# EAGLE design mega32u4 (EAGLE 6.2)
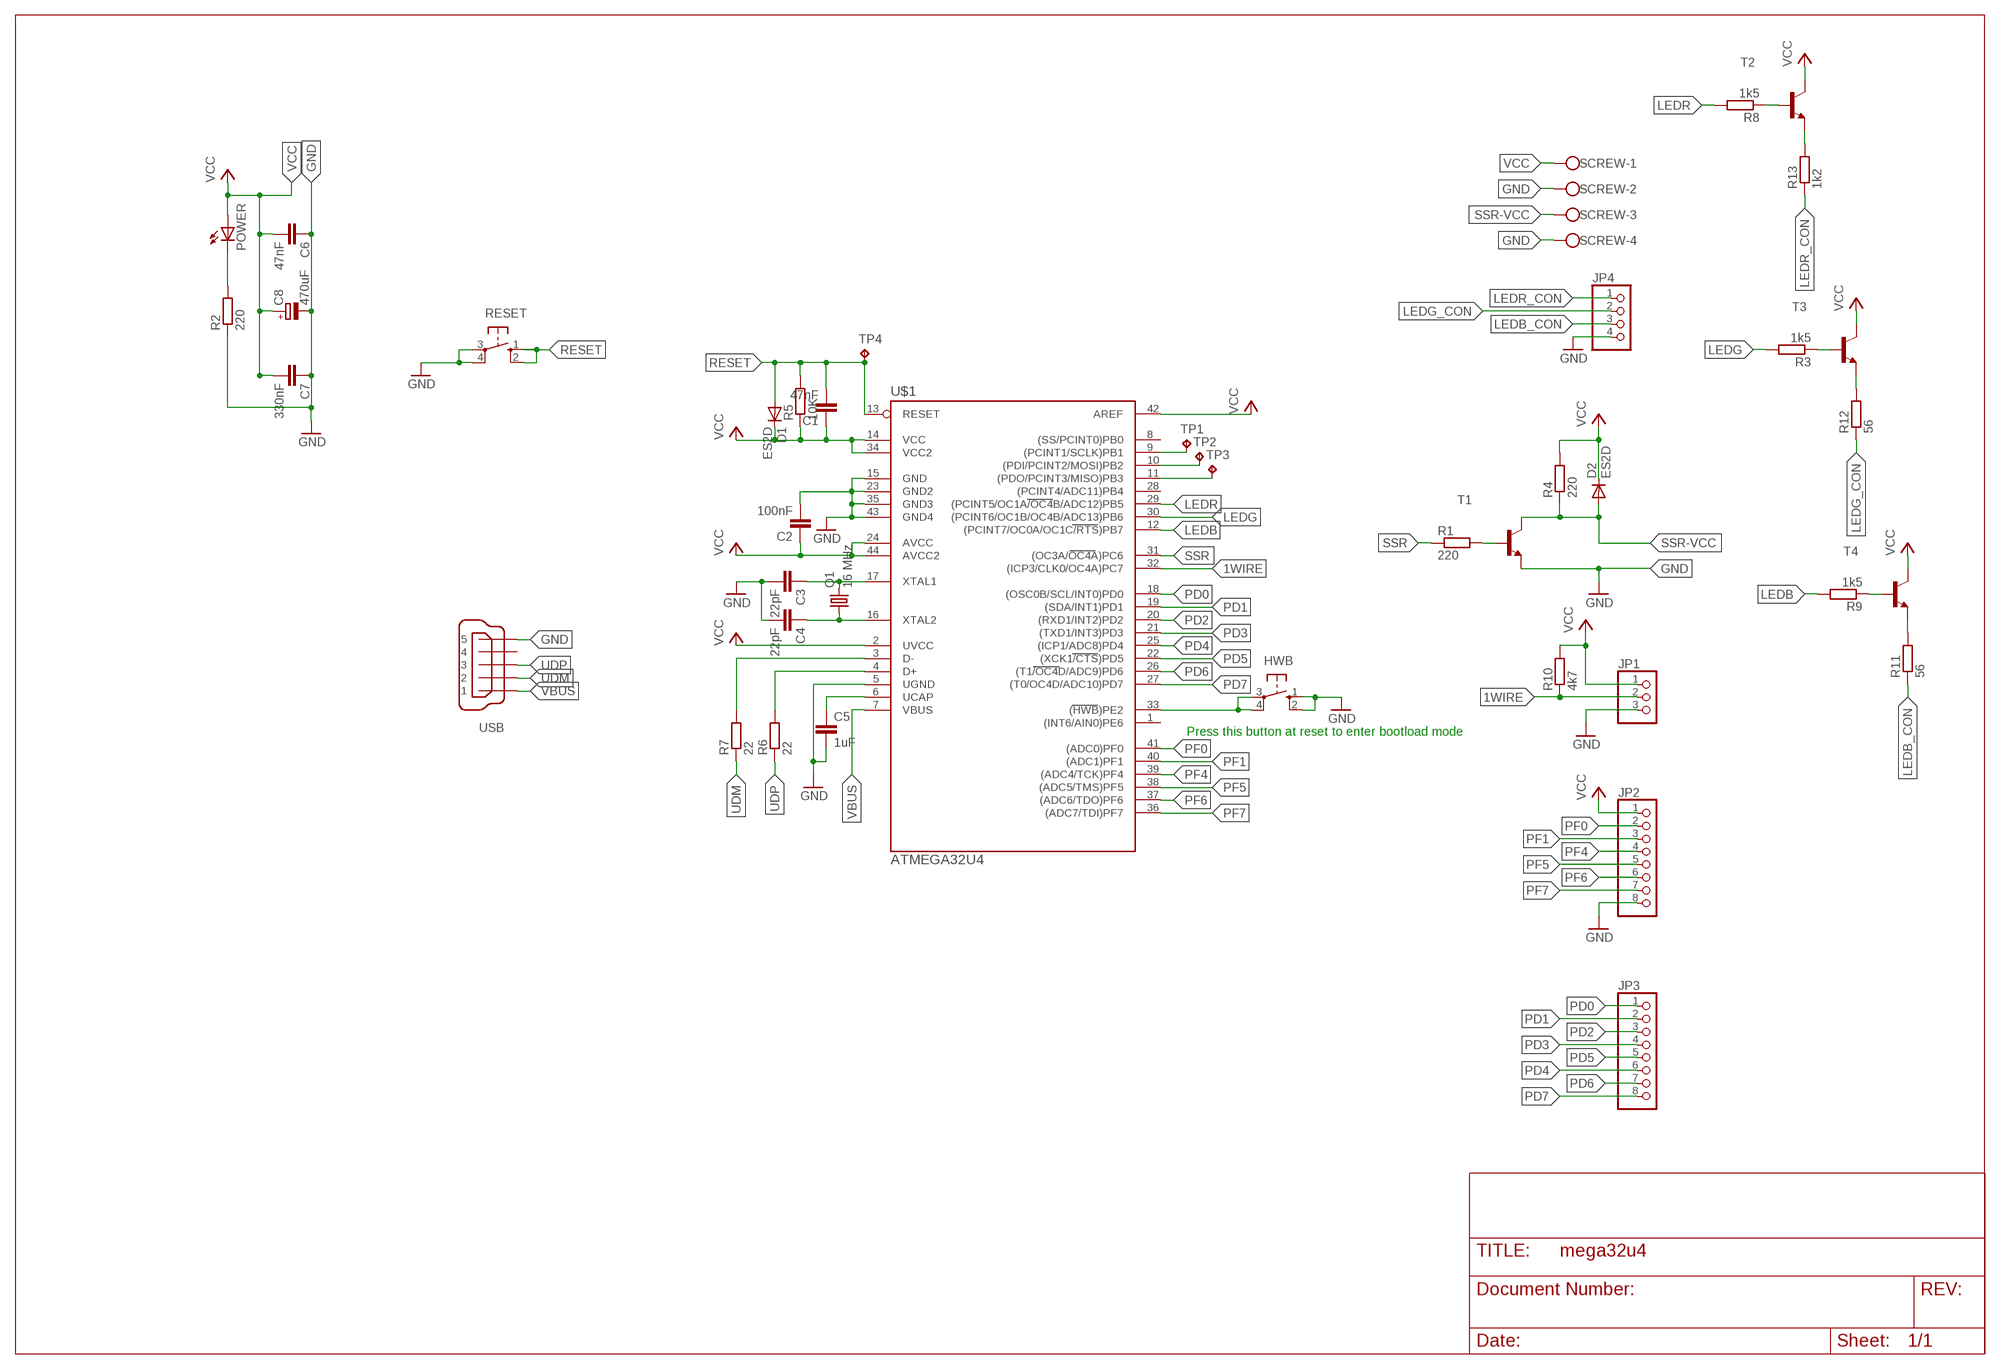
[diagram p0: schematic, sheet 1]

## Parts
C1  47nF  C-EUC0805K  [C0805K]
C2  100nF  C-EUC0805K  [C0805K]
C3  22pF  C-EUC0805K  [C0805K]
C4  22pF  C-EUC0805K  [C0805K]
C5  1uF  C-EUC0805K  [C0805K]
C6  47nF  C-EUC0805K  [C0805K]
C7  330nF  C-EUC0805K  [C0805K]
C8  470uF  CPOL-EU150CLZ-0810  [150CLZ-0810]
D1  ES2D  [SMB]
D2  ES2D  [SMB]
HWB  10-XX  [B3F-10XX]
JP1  PINHD-1X3  [1X03]
JP2  PINHD-1X8  [1X08]
JP3  PINHD-1X8  [1X08]
JP4  PINHD-1X4  [1X04]
POWER  LEDSML0805  [SML0805]
Q1  16 MHz  CRYSTALCTS406  [CTS406]
R1  220  R-EU_R0805  [R0805]
R2  220  R-EU_R0805  [R0805]
R3  1k5  R-EU_R0805  [R0805]
R4  220  R-EU_R0805  [R0805]
R5  10K  R-EU_R0805  [R0805]
R6  22  R-EU_R0805  [R0805]
R7  22  R-EU_R0805  [R0805]
R8  1k5  R-EU_R0805  [R0805]
R9  1k5  R-EU_R0805  [R0805]
R10  4k7  R-EU_R0805  [R0805]
R11  56  R-EU_R0805  [R0805]
R12  56  R-EU_R0805  [R0805]
R13  1k2  R-EU_R0805  [R0805]
RESET  10-XX  [B3F-10XX]
SCREW  W237-4  [W237-4]
T1  BC817-25-NPN-SOT23-BEC  [SOT23-BEC]
T2  BC817-25-NPN-SOT23-BEC  [SOT23-BEC]
T3  BC817-25-NPN-SOT23-BEC  [SOT23-BEC]
T4  BC817-25-NPN-SOT23-BEC  [SOT23-BEC]
TP1  TPTP10R  [TP10R]
TP2  TPTP10R  [TP10R]
TP3  TPTP10R  [TP10R]
TP4  TPTP10R  [TP10R]
U$1  ATMEGA32U4  ATMEGA32U4-AU  [TQFP44]
USB  MINI-USB-32005-201  [32005-201]

## Nets
1WIRE: JP1.2 R10.1 U$1.32((ICP3/CLK0/OC4A)PC7)
GND: C2.2 C3.2 C4.2 C5.2 C6.1 C7.1 C8.- HWB.1(S) HWB.2(S1) JP1.3 JP2.8 JP4.4 R2.1 RESET.3(P) RESET.4(P1) SCREW.2 SCREW.4 T1.E U$1.5(UGND) U$1.15(GND) U$1.23(GND2) U$1.35(GND3) U$1.43(GND4) USB.5
LEDB: R9.2 U$1.12((PCINT7/OC0A/OC1C/RTS)PB7)
LEDB_CON: JP4.3 R11.1
LEDG: R3.2 U$1.30((PCINT6/OC1B/OC4B/ADC13)PB6)
LEDG_CON: JP4.2 R12.1
LEDR: R8.2 U$1.29((PCINT5/OC1A/OC4B/ADC12)PB5)
LEDR_CON: JP4.1 R13.1
N$1: TP1.TP U$1.9((PCINT1/SCLK)PB1)
N$2: C3.1 Q1.3 U$1.17(XTAL1)
N$3: C4.1 Q1.1 U$1.16(XTAL2)
N$4: C5.1 U$1.6(UCAP)
N$5: R1.2 T1.B
N$6: R6.2 U$1.4(D+)
N$7: R7.2 U$1.3(D-)
N$8: R8.1 T2.B
N$9: R3.1 T3.B
N$10: HWB.3(P) HWB.4(P1) U$1.33((HWB)PE2)
N$11: R9.1 T4.B
N$12: TP2.TP U$1.10((PDI/PCINT2/MOSI)PB2)
N$13: POWER.C R2.2
N$14: R11.2 T4.E
N$15: R12.2 T3.E
N$16: R13.2 T2.E
N$17: TP3.TP U$1.11((PDO/PCINT3/MISO)PB3)
PD0: JP3.1 U$1.18((OSC0B/SCL/INT0)PD0)
PD1: JP3.2 U$1.19((SDA/INT1)PD1)
PD2: JP3.3 U$1.20((RXD1/INT2)PD2)
PD3: JP3.4 U$1.21((TXD1/INT3)PD3)
PD4: JP3.6 U$1.25((ICP1/ADC8)PD4)
PD5: JP3.5 U$1.22((XCK1/CTS)PD5)
PD6: JP3.7 U$1.26((T1/OC4D/ADC9)PD6)
PD7: JP3.8 U$1.27((T0/OC4D/ADC10)PD7)
PF0: JP2.2 U$1.41((ADC0)PF0)
PF1: JP2.3 U$1.40((ADC1)PF1)
PF4: JP2.4 U$1.39((ADC4/TCK)PF4)
PF5: JP2.5 U$1.38((ADC5/TMS)PF5)
PF6: JP2.6 U$1.37((ADC6/TDO)PF6)
PF7: JP2.7 U$1.36((ADC7/TDI)PF7)
RESET: C1.2 D1.A R5.2 RESET.1(S) RESET.2(S1) TP4.TP U$1.13(RESET)
SSR: R1.1 U$1.31((OC3A/OC4A)PC6)
SSR-VCC: D2.A R4.1 SCREW.3 T1.C
UDM: R7.1 USB.2
UDP: R6.1 USB.3
VBUS: U$1.7(VBUS) USB.1
VCC: C1.1 C2.1 C6.2 C7.2 C8.+ D1.C D2.C JP1.1 JP2.1 POWER.A R4.2 R5.1 R10.2 SCREW.1 T2.C T3.C T4.C U$1.2(UVCC) U$1.14(VCC) U$1.24(AVCC) U$1.34(VCC2) U$1.42(AREF) U$1.44(AVCC2)
Unconnected: U$1.1((INT6/AIN0)PE6) U$1.8((SS/PCINT0)PB0) U$1.28((PCINT4/ADC11)PB4) USB.4

## Notes on the sheet
- Press this button at reset to enter bootload mode

## Library data of the parts
C1-C7 = resistor:C-EU: CAPACITOR, European symbol
C8 = resistor:CPOL-EU: POLARIZED CAPACITOR, European symbol
D1 D2 = diode:ES2D: DIODE super fast rectifier, 2 A
HWB RESET = switch-omron:10-XX: OMRON SWITCH; MPN: B3F-1000; OC_FARNELL: 176432; OC_NEWARK: 36M3542
JP1 = pinhead:PINHD-1X3: PIN HEADER
JP2 JP3 = pinhead:PINHD-1X8: PIN HEADER
JP4 = pinhead:PINHD-1X4: PIN HEADER
POWER = led:LED: LED OSRAM: - CHIPLED LG R971, LG N971, LY N971, LG Q971, LY Q971, LO R971, LY R971 LH N974, LH R974 LS Q976, LO Q976, LY Q976 LO Q996 - Hyper CHIPLED LW Q18S LB Q993, LB Q99A, LB R99A - SideLED LS A670, LO A670, LY A670, LG A670, LP A670 LB A673, LV A673, LT A673, LW A673 LH A674 LY A675 LS A676, LA A676, LO A676, LY A676, LW A676 LS A679, LY A679, LG A679 - Hyper Micro SIDELED® LS Y876, LA Y876, LO Y876, LY Y876 LT Y87S - SmartLED LW L88C, LW L88S LB L89C, LB L89S, LG L890 LS L89K, LO L89K, LY L89K LS L896, LA L896, LO L896, LY L896 - TOPLED LS T670, LO T670, LY T670, LG T670, LP T670 LSG T670, LSP T670, LSY T670, LOP T670, LYG T670 LG T671, LOG T671, LSG T671 LB T673, LV T673, LT T673, LW T673 LH T674 LS T676, LA T676, LO T676, LY T676, LB T676, LH T676, LSB T676, LW T676 LB T67C, LV T67C, LT T67C, LS T67K, LO T67K, LY T67K, LW E67C LS E67B, LA E67B, LO E67B, LY E67B, LB E67C, LV E67C, LT E67C LW T67C LS T679, LY T679, LG T679 LS T770, LO T770, LY T770, LG T770, LP T770 LB T773, LV T773, LT T773, LW T773 LH T774 LS E675, LA E675, LY E675, LS T675 LS T776, LA T776, LO T776, LY T776, LB T776 LHGB T686 LT T68C, LB T68C - Hyper Mini TOPLED® LB M676 - Mini TOPLED Santana® LG M470 LS M47K, LO M47K, LY M47K Source: http://www.osram.convergy.de LUXEON: - LUMILED® LXK2-PW12-R00, LXK2-PW12-S00, LXK2-PW14-U00, LXK2-PW14-V00 LXK2-PM12-R00, LXK2-PM12-S00, LXK2-PM14-U00 LXK2-PE12-Q00, LXK2-PE12-R00, LXK2-PE12-S00, LXK2-PE14-T00, LXK2-PE14-U00 LXK2-PB12-K00, LXK2-PB12-L00, LXK2-PB12-M00, LXK2-PB14-N00, LXK2-PB14-P00, LXK2-PB14-Q00 LXK2-PR12-L00, LXK2-PR12-M00, LXK2-PR14-Q00, LXK2-PR14-R00 LXK2-PD12-Q00, LXK2-PD12-R00, LXK2-PD12-S00 LXK2-PH12-R00, LXK2-PH12-S00 LXK2-PL12-P00, LXK2-PL12-Q00, LXK2-PL12-R00 Source: www.luxeon.com KINGBRIGHT: KA-3528ASYC Source: www.kingbright.com
Q1 = crystal:CRYSTAL: CRYSTAL; OC_FARNELL: unknown; OC_NEWARK: unknown
R1-R13 = resistor:R-EU_: RESISTOR, European symbol
SCREW = con-wago-500:W237-4: WAGO SCREW CLAMP; OC_FARNELL: unknown; OC_NEWARK: unknown
T1-T4 = transistor-neu-to92:*-NPN-: NPN Transistror
TP1-TP4 = testpad:TP: Test pad
U$1 = mega32U4:ATMEGA32U4-AU
USB = con-cypressindustries:MINI-USB-: MINI USB-B Conector Source: www.cypressindustries.com; OC_FARNELL: unknown; OC_NEWARK: unknown

## Board
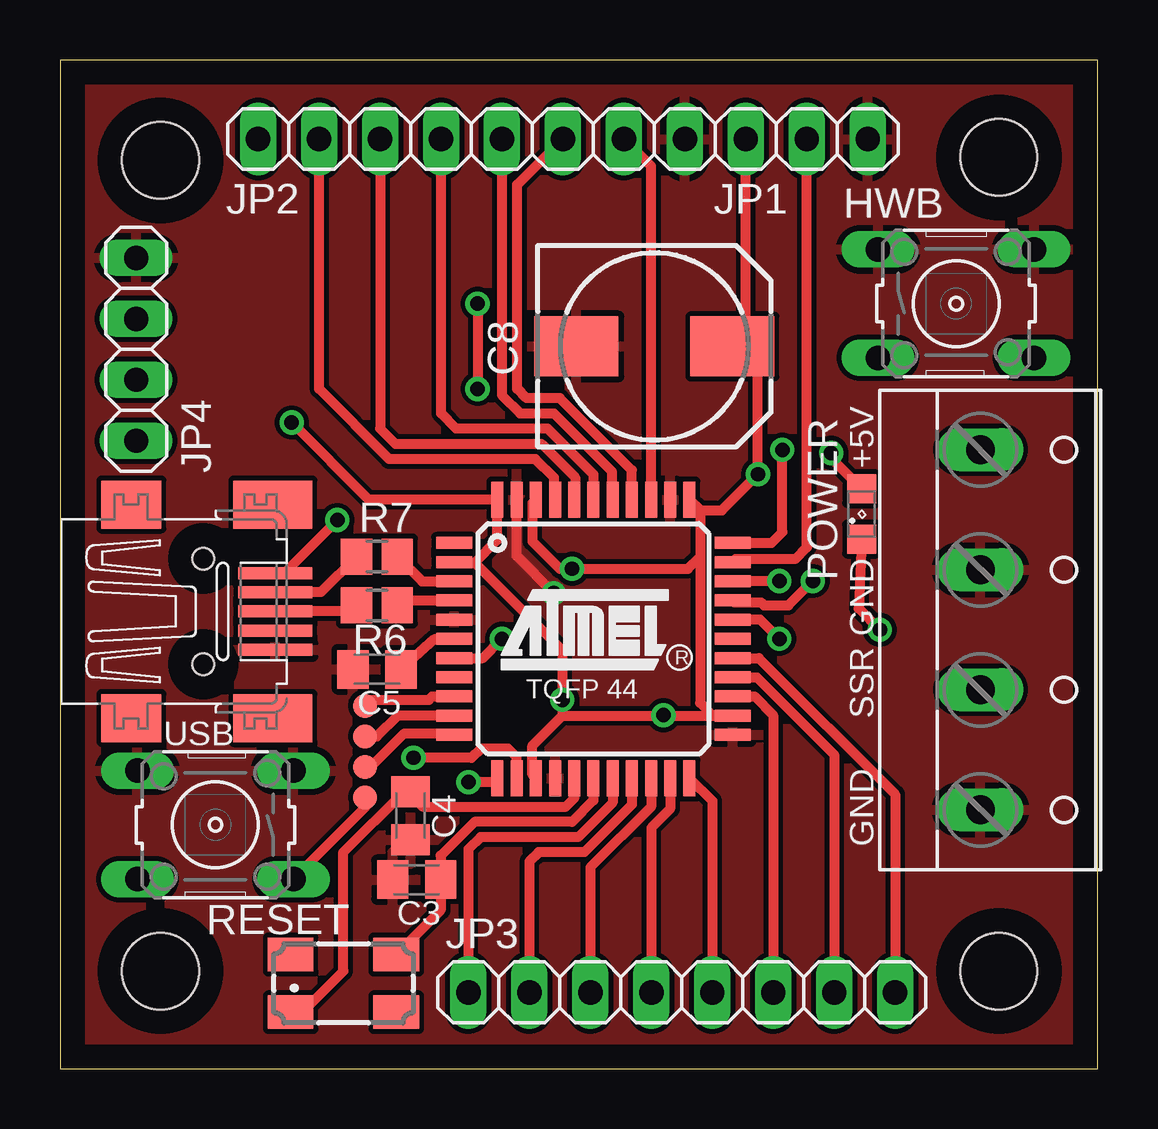
[diagram p1: board, top side]
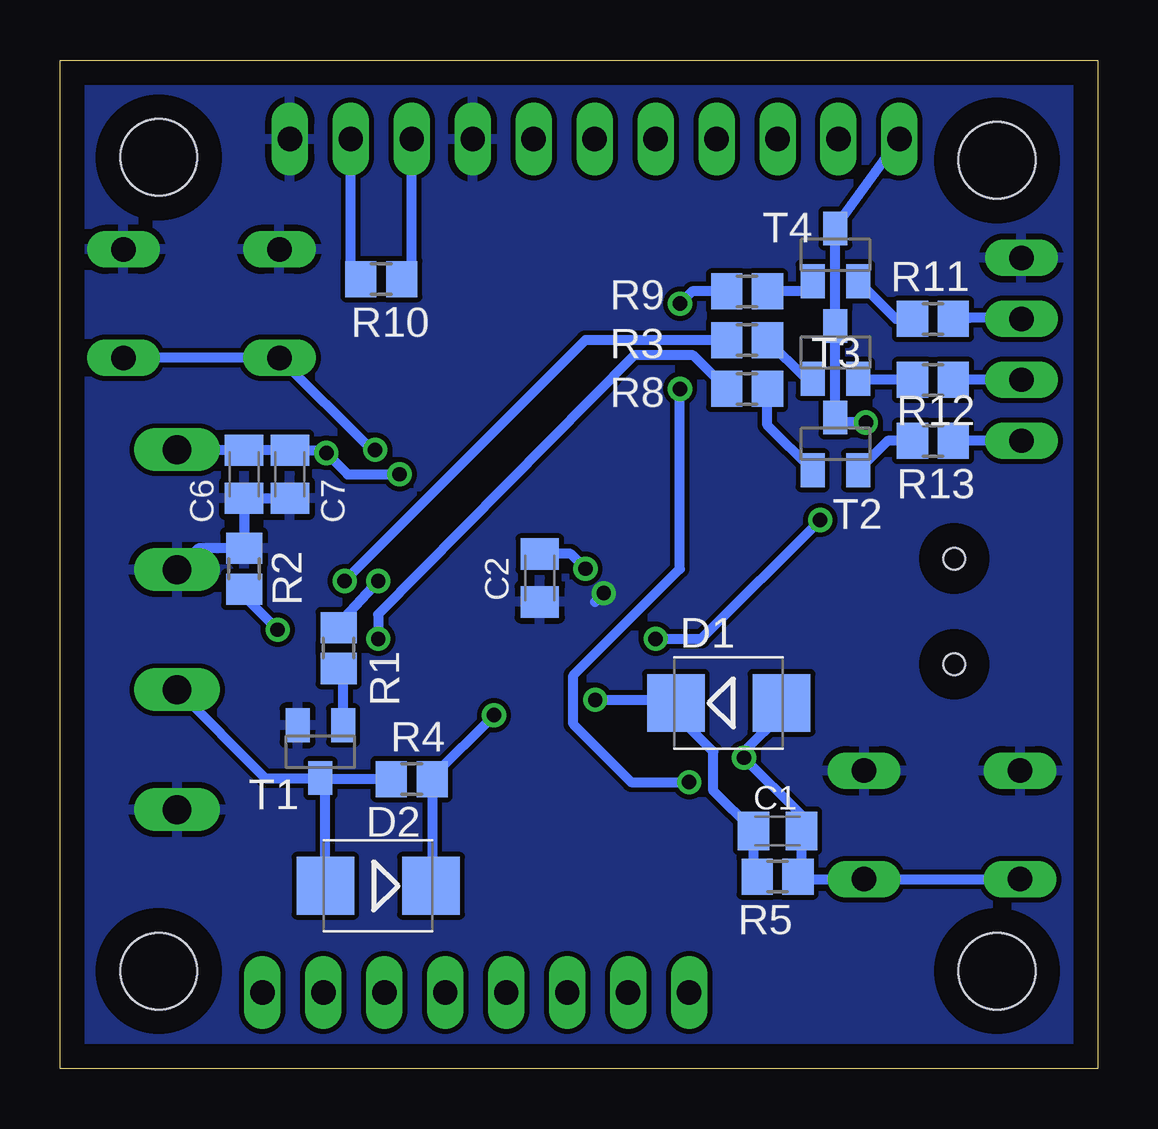
[diagram p2: board, bottom side, seen from below]

Size 43.23 x 42.03 mm. Coordinates in mm from the lower left corner, seen from the top.
Outline: 0,0 43.23,0 43.23,42.03 0,42.03 0,0
Copper layers (1*16): Top 0.035mm / dielectric 1.5mm / Bottom 0.035mm
Design rules: minimum track width 10mil, minimum drill 12mil, track to track 8mil, track to pad 8mil, pad to pad 8mil, via to via 8mil, smd to smd 8mil, copper to edge 40mil, drill to drill 8mil, minimum pad ring 10mil, minimum via ring 8mil, stop-mask expansion 4mil, vias tented up to drill 0mil, thermal gap 10mil
Holes 3.2 mm at 4.19,4.06 39.12,37.97 4.19,37.85 39.12,4.06

### Footprints (pad centres in the part's own frame; a part is rotated, then mirrored left to right if it is on the bottom)
C0805K = smd 1.3 x 1.6: 1 -1,0; 2 1,0
150CLZ-0810 = smd 3.5 x 2.5: + 3.25,0; - -3.25,0
SMB = smd 2.4 x 2.4: A 2.2,0; C -2.2,0
B3F-10XX = drill 1.016 long: 1 -3.251,2.261; 2 3.251,2.261; 3 -3.251,-2.261; 4 3.251,-2.261
1X03 = drill 1.016 long: 1 -2.54,0; 2 0,0; 3 2.54,0
1X08 = drill 1.016 long: 1 -8.89,0; 2 -6.35,0; 3 -3.81,0; 4 -1.27,0; 5 1.27,0; 6 3.81,0; 7 6.35,0; 8 8.89,0
1X04 = drill 1.016 long: 1 -3.81,0; 2 -1.27,0; 3 1.27,0; 4 3.81,0
SML0805 = smd 1.2 x 1.2: A 1.05,0; C -1.05,0
CTS406 = smd 1.9 x 1.4: 1 -2.2,-1.2; 2 2.2,-1.2; 3 2.2,1.2; 4 -2.2,1.2
R0805 = smd 1.3 x 1.5: 1 -0.85,0; 2 0.85,0
W237-4 = drill 1.194 long: 1 -7.5,-1.27; 2 -2.5,-1.27; 3 2.5,-1.27; 4 7.5,-1.27
SOT23-BEC = smd 1 x 1.4: B -0.95,-1.1; C 0,1.1; E 0.95,-1.1
TP10R = smd 1 x 1: TP 0,0
TQFP44 = smd 1.5 x 0.5: 1 -5.8,4; 2 -5.8,3.2; 3 -5.8,2.4; 4 -5.8,1.6; 5 -5.8,0.8; 6 -5.8,0; 7 -5.8,-0.8; 8 -5.8,-1.6; 9 -5.8,-2.4; 10 -5.8,-3.2; 11 -5.8,-4; 23 5.8,-4; 24 5.8,-3.2; 25 5.8,-2.4; 26 5.8,-1.6; 27 5.8,-0.8; 28 5.8,0; 29 5.8,0.8; 30 5.8,1.6; 31 5.8,2.4; 32 5.8,3.2; 33 5.8,4 | smd 0.5 x 1.5: 12 -4,-5.8; 13 -3.2,-5.8; 14 -2.4,-5.8; 15 -1.6,-5.8; 16 -0.8,-5.8; 17 0,-5.8; 18 0.8,-5.8; 19 1.6,-5.8; 20 2.4,-5.8; 21 3.2,-5.8; 22 4,-5.8; 34 4,5.8; 35 3.2,5.8; 36 2.4,5.8; 37 1.6,5.8; 38 0.8,5.8; 39 0,5.8; 40 -0.8,5.8; 41 -1.6,5.8; 42 -2.4,5.8; 43 -3.2,5.8; 44 -4,5.8
32005-201 = smd 3.1 x 0.5: 1 3,1.6; 2 3,0.8; 3 3,0; 4 3,-0.8; 5 3,-1.6 | smd 2.5 x 2: M1 -3,-4.45; M2 -3,4.45 | smd 3.3 x 2: M3 2.9,4.45; M4 2.9,-4.45 | hole 0.9: 0,2.2; 0,-2.2

### Placement (x,y rotation side)
C1  13.34,9.91 0 bottom
C2  23.24,20.45 270 bottom
C3  14.86,7.87 180 top
C4  14.6,10.54 270 top
C5  13.21,16.64 180 top
C6  35.56,24.77 90 bottom
C7  33.66,24.77 90 bottom
C8  24.77,30.1 0 top
D1  15.37,15.24 0 bottom
D2  29.97,7.62 180 bottom
HWB  37.34,31.88 0 top
JP1  31.12,38.73 0 top
JP2  17.15,38.73 0 top
JP3  25.91,3.18 0 top
JP4  3.18,29.97 90 top
POWER  33.4,23.11 90 top
Q1  11.81,3.56 0 top
R1  31.62,17.53 270 bottom
R2  35.56,20.83 270 bottom
R3  14.6,30.35 180 bottom
R4  28.58,12.07 0 bottom
R5  13.34,8 0 bottom
R6  13.21,19.3 0 top
R7  13.21,21.34 0 top
R8  14.6,28.32 180 bottom
R9  14.6,32.39 180 bottom
R10  29.84,32.89 0 bottom
R11  6.86,31.24 180 bottom
R12  6.86,28.7 180 bottom
R13  6.86,26.16 180 bottom
RESET  6.48,10.16 180 top
SCREW  39.62,18.29 270 top
T1  32.38,13.21 180 bottom
T2  10.92,26.04 0 bottom
T3  10.92,29.85 0 bottom
T4  10.92,33.91 0 bottom
TP1  12.7,15.11 0 top
TP2  12.7,13.84 0 top
TP3  12.7,12.57 0 top
TP4  12.7,11.3 0 top
U$1  22.23,17.91 0 top
USB  5.97,19.05 0 top

### Tracks (layer width: path | path; a pad name or v marks a point on that pad's centre or on a via)
1WIRE
  Top 0.406: JP1.2 31.12,21.72 30.63,21.23 28.15,21.23 U$1.32
  Bottom 0.406: R10.1 31.12,33.31 JP1.2
GND  (via drill 0.6)
  Top 0.406: v20.57,19.81 19.02,21.36 U$1.43
  Bottom 0.406: SCREW.2 37.46,21.68 R2.1 C6.1 C7.1 | 20.94,19.45 v20.57,19.81
  pour Top: -0.13,41.91 43.31,42.04 43.31,0.13 -0.13,0
  pour Bottom: 43.18,0 -0.13,0 -0.13,42.04 43.18,42.04
LEDB  (via drill 0.6)
  Top 0.406: v17.4,31.88 v17.4,28.32 | U$1.12 18.06,11.94 v17.02,11.94
  Bottom 0.406: v17.4,28.32 17.4,20.83 21.84,16.38 21.84,14.35 19.43,11.94 v17.02,11.94 | R9.2 16.89,32.39 v17.4,31.88
LEDB_CON
  Bottom 0.406: JP4.3 2.07,31.29 5.33,31.29 R11.1
LEDG  (via drill 0.6)
  Top 0.406: U$1.30 28.1,19.43 29.21,19.43 29.34,19.3 30.35,19.3 v31.37,20.32
  Bottom 0.406: v31.37,20.32 21.34,30.35 R3.2
LEDG_CON
  Bottom 0.406: JP4.2 R12.1
LEDR  (via drill 0.6)
  Top 0.406: v29.97,17.91 29.17,18.71 U$1.29
  Bottom 0.406: v29.97,17.91 29.97,18.92 19.3,29.72 16.85,29.72 R8.2
LEDR_CON
  Bottom 0.406: JP4.1 R13.1
N$1
  Top 0.406: TP1.TP 12.95,15.37 15.37,15.37 15.51,15.51 U$1.9
N$2
  Top 0.406: U$1.17 22.23,11.18 21.34,10.29 17.27,10.29 15.86,8.87 C3.1 15.86,6.6 Q1.3
N$3
  Top 0.406: U$1.16 21.42,11.27 21.08,10.92 15.11,10.92 14.6,11.43 C4.1 14.34,11.54 11.81,9.02 11.81,4.06 10.1,2.36 Q1.1
N$4
  Top 0.406: C5.1 14.35,16.76 15.62,17.91 U$1.6
N$5
  Bottom 0.406: T1.B 31.44,16.49 R1.2
N$6
  Top 0.406: R6.2 14.52,19.51 U$1.4
N$7
  Top 0.406: R7.2 15.09,20.31 U$1.3
N$8
  Bottom 0.406: T2.B 13.76,26.82 R8.1
N$9
  Bottom 0.406: T3.B 12.15,28.75 R3.1
N$10  (via drill 0.6)
  Top 0.406: U$1.33 29.65,21.91 30.1,22.35 v30.1,25.78
  Bottom 0.406: v30.1,25.78 30.25,25.78 HWB.3 HWB.4
N$11
  Bottom 0.406: T4.B 12.3,32.39 R9.1
N$12
  Top 0.406: U$1.10 14.07,14.71 13.21,13.84 TP2.TP
N$13  (via drill 0.6)
  Top 0.406: POWER.C 33.27,19.18 v34.16,18.29
  Bottom 0.406: v34.16,18.29 35.43,19.56 R2.2
N$14
  Bottom 0.406: R11.2 8.41,31.24 T4.E
N$15
  Bottom 0.406: R12.2 9.93,28.7 T3.E
N$16
  Bottom 0.406: R13.2 8.74,26.16 T2.E
N$17
  Top 0.406: TP3.TP 12.95,12.57 14.35,13.97 16.36,13.97 U$1.11
PD0
  Top 0.406: U$1.18 23.02,11.09 21.59,9.65 17.53,9.65 17.02,9.14 JP3.1
PD1
  Top 0.406: U$1.19 23.83,11 21.84,9.02 19.94,9.02 19.56,8.64 JP3.2
PD2
  Top 0.406: U$1.20 24.62,10.91 22.1,8.38 JP3.3
PD3
  Top 0.406: U$1.21 25.42,10.82 24.64,10.03 JP3.4
PD4
  Top 0.406: U$1.25 28.94,15.51 29.72,14.73 JP3.6
PD5
  Top 0.406: U$1.22 27.18,11.15 JP3.5
PD6
  Top 0.406: U$1.26 29.03,16.31 32.26,13.08 JP3.7
PD7
  Top 0.406: U$1.27 29.12,17.11 34.8,11.43 JP3.8
PF0
  Top 0.406: U$1.41 20.57,23.76 20.57,24.64 19.81,25.4 13.72,25.4 10.8,28.32 JP2.2
PF1
  Top 0.406: U$1.40 21.46,23.75 21.46,24.64 20.07,26.04 13.97,26.04 13.34,26.67 JP2.3
PF4
  Top 0.406: U$1.39 22.23,24.77 20.32,26.67 16.51,26.67 15.88,27.31 JP2.4
PF5
  Top 0.406: U$1.38 22.99,23.75 22.99,24.89 20.57,27.31 19.18,27.31 18.41,28.07 JP2.5
PF6
  Top 0.406: U$1.37 23.83,24.94 20.83,27.94 19.43,27.94 19.05,28.32 19.05,36.83 JP2.6
PF7
  Top 0.406: U$1.36 24.62,37.61 JP2.7
RESET  (via drill 0.6)
  Top 0.406: U$1.13 19.02,12.98 18.67,13.34 17.53,13.34 17.15,12.95 v14.73,12.95 | TP4.TP 12.7,10.87 RESET.1
  Bottom 0.406: D1.A 13.17,14.77 14.73,13.21 v14.73,12.95 12.34,10.56 C1.2 12.34,8.15 R5.2 12.38,7.9 RESET.1 RESET.2
SSR  (via drill 0.6)
  Top 0.406: U$1.31 28.04,20.32 v29.97,20.32
  Bottom 0.406: R1.1 31.62,18.54 v29.97,20.32
SSR-VCC
  Bottom 0.406: R4.1 32.34,12.07 T1.C | SCREW.3 34.67,12.11 T1.C | D2.A 32.17,11.9 32.38,11.9 T1.C
UDM
  Top 0.406: R7.1 10.87,19.85 USB.2
UDP
  Top 0.406: R6.1 12.23,19.05 USB.3
VBUS  (via drill 0.6)
  Top 0.406: U$1.7 17.62,17.11 v18.41,17.91 | v11.56,22.86 9.35,20.65 USB.1
  Bottom 0.406: v18.41,17.91 16.51,17.91 v11.56,22.86
VCC  (via drill 0.6)
  Top 0.406: U$1.14 19.69,12.25 19.69,13.46 20.93,14.71 | 20.93,14.71 25.02,14.71 | 25.02,14.71 27.3,14.71 | U$1.2 16.45,21.08 17.27,21.08 | 17.27,21.08 18.23,22.04 U$1.44 12.87,23.71 v9.65,26.92 | 17.27,21.08 20.93,17.42 v20.93,15.37 20.93,14.71 | U$1.34 26.67,23.26 | 26.67,23.26 26.67,21.34 | 26.67,21.34 26.67,15.24 27.18,14.73 27.3,14.71 | U$1.42 19.69,23.57 19.69,21.97 20.83,20.83 v21.34,20.83 26.16,20.83 26.67,21.34 | 26.67,23.26 27.58,23.26 v29.08,24.77 29.08,29.03 C8.+ | U$1.24 27.3,14.71 | v25.15,14.73 25.04,14.73 25.02,14.71 | 29.08,30.17 C8.+ | C8.+ 28.58,30.68 JP1.1 | POWER.A 32.13,25.43 v32.13,25.65
  Bottom 0.406: 23.24,21.34 C2.1 21.95,21.45 v21.34,20.83 | v20.93,15.37 17.69,15.37 D1.C 17.57,14.77 16,13.21 16,11.57 C1.1 14.34,8.15 R5.1 | SCREW.1 38.33,25.77 C6.2 C7.2 32.24,25.77 v32.13,25.65 31.24,24.77 v29.08,24.77 | v25.15,14.73 27.73,12.15 R4.2 27.73,7.67 D2.C | R10.2 28.58,33.31 JP1.1 | JP2.1 10.92,35.05 T4.C T3.C T2.C 10.71,26.92 v9.65,26.92

### Text on the board
tNames: +5V | GND | SSR | GND
tDocu: ChaosCoffeeControl | v0.2